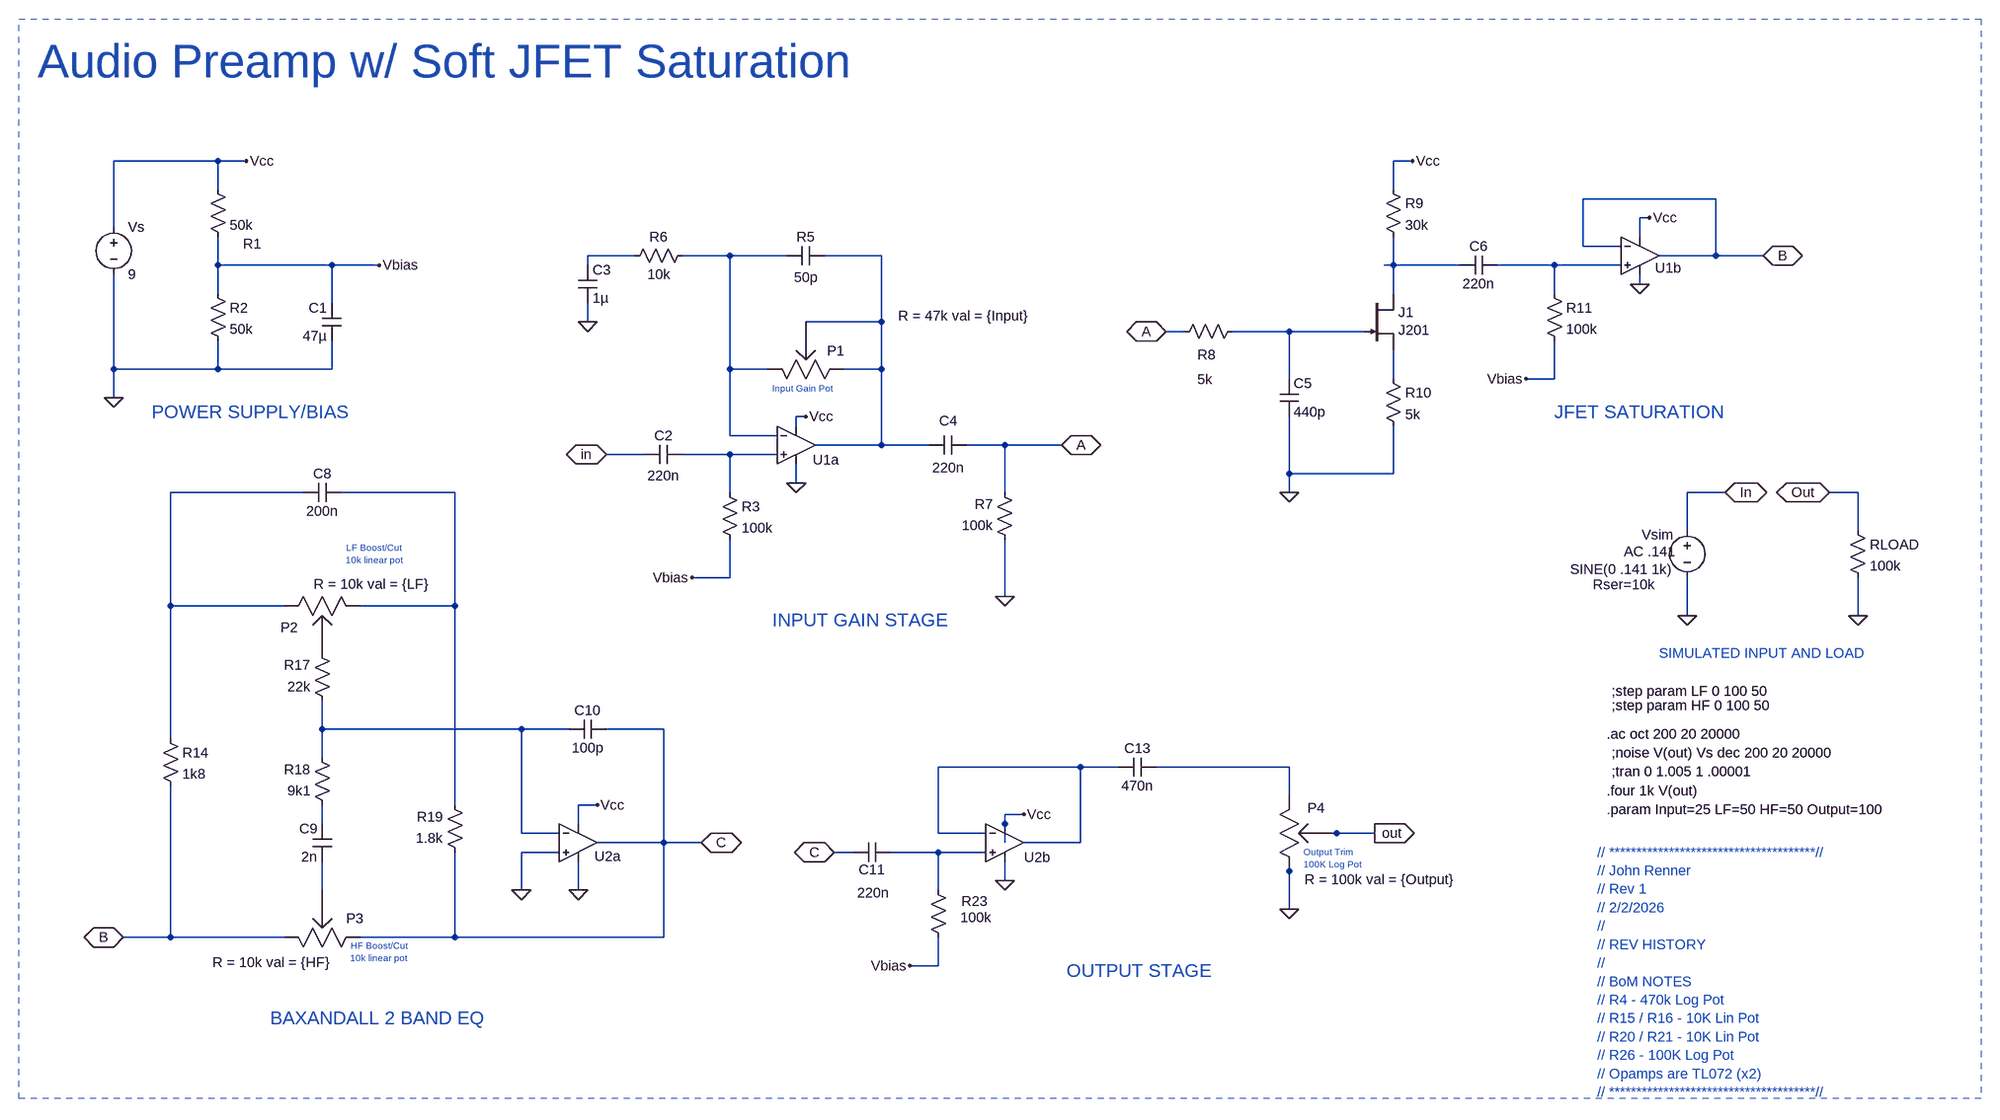
[diagram p0: schematic simulation.asc]
simulation.asc, the LTspice schematic file:
Version 4
SHEET 1 5132 1604
WIRE -912 -352 -1088 -352
WIRE -864 -352 -912 -352
WIRE 1104 -352 1072 -352
WIRE -912 -304 -912 -352
WIRE 1072 -304 1072 -352
WIRE 1616 -288 1392 -288
WIRE 1504 -256 1488 -256
WIRE -1088 -240 -1088 -352
WIRE 1488 -224 1488 -256
WIRE 1392 -208 1392 -288
WIRE 1456 -208 1392 -208
WIRE -208 -192 -288 -192
WIRE -48 -192 -128 -192
WIRE 48 -192 -48 -192
WIRE 208 -192 112 -192
WIRE 1616 -192 1616 -288
WIRE 1616 -192 1520 -192
WIRE 1696 -192 1616 -192
WIRE -912 -176 -912 -224
WIRE -720 -176 -912 -176
WIRE -640 -176 -720 -176
WIRE -288 -176 -288 -192
WIRE 1072 -176 1072 -224
WIRE 1072 -176 1056 -176
WIRE 1184 -176 1072 -176
WIRE 1344 -176 1248 -176
WIRE 1456 -176 1344 -176
WIRE 1488 -144 1488 -160
WIRE -912 -128 -912 -176
WIRE 1072 -128 1072 -176
WIRE 1344 -128 1344 -176
WIRE -720 -112 -720 -176
WIRE -288 -80 -288 -112
WIRE 208 -80 208 -192
WIRE 208 -80 80 -80
WIRE 720 -64 688 -64
WIRE 896 -64 800 -64
WIRE 1024 -64 896 -64
WIRE -1088 0 -1088 -160
WIRE -912 0 -912 -48
WIRE -912 0 -1088 0
WIRE -720 0 -720 -48
WIRE -720 0 -912 0
WIRE -48 0 -48 -192
WIRE 16 0 -48 0
WIRE 208 0 208 -80
WIRE 208 0 144 0
WIRE 896 16 896 -64
WIRE 1072 16 1072 -32
WIRE 1344 16 1344 -48
WIRE 1344 16 1296 16
WIRE -1088 48 -1088 0
WIRE 80 80 64 80
WIRE 64 96 64 80
WIRE -48 112 -48 0
WIRE 32 112 -48 112
WIRE 208 128 208 0
WIRE 208 128 96 128
WIRE 288 128 208 128
WIRE 416 128 352 128
WIRE 512 128 416 128
WIRE -192 144 -256 144
WIRE -48 144 -128 144
WIRE 32 144 -48 144
WIRE 896 176 896 80
WIRE 1072 176 1072 96
WIRE 1072 176 896 176
WIRE 64 192 64 160
WIRE -768 208 -992 208
WIRE -512 208 -704 208
WIRE -48 208 -48 144
WIRE 416 208 416 128
WIRE 896 208 896 176
WIRE 1632 208 1568 208
WIRE 1856 208 1808 208
WIRE 1568 272 1568 208
WIRE 1856 272 1856 208
WIRE -48 352 -48 288
WIRE -48 352 -112 352
WIRE 416 384 416 288
WIRE -992 400 -992 208
WIRE -800 400 -992 400
WIRE -512 400 -512 208
WIRE -512 400 -672 400
WIRE 1568 416 1568 352
WIRE 1856 416 1856 352
WIRE -736 608 -736 560
WIRE -400 608 -736 608
WIRE -320 608 -400 608
WIRE -160 608 -256 608
WIRE -992 624 -992 400
WIRE -736 656 -736 608
WIRE 544 672 304 672
WIRE 608 672 544 672
WIRE 896 672 672 672
WIRE 896 720 896 672
WIRE -512 736 -512 400
WIRE -272 736 -304 736
WIRE 448 752 416 752
WIRE -736 768 -736 736
WIRE -304 768 -304 736
WIRE 416 768 416 752
WIRE -400 784 -400 608
WIRE -336 784 -400 784
WIRE 304 784 304 672
WIRE 384 784 304 784
WIRE 976 784 960 784
WIRE 1040 784 976 784
WIRE -160 800 -160 608
WIRE -160 800 -272 800
WIRE -96 800 -160 800
WIRE 416 800 416 768
WIRE 544 800 544 672
WIRE 544 800 448 800
WIRE -336 816 -400 816
WIRE 160 816 128 816
WIRE 304 816 224 816
WIRE 384 816 304 816
WIRE 896 848 896 832
WIRE 416 864 416 832
WIRE -736 880 -736 832
WIRE -400 880 -400 816
WIRE -304 880 -304 832
WIRE 304 880 304 816
WIRE 896 912 896 848
WIRE -992 960 -992 704
WIRE -992 960 -1072 960
WIRE -800 960 -992 960
WIRE -512 960 -512 816
WIRE -512 960 -672 960
WIRE -160 960 -160 800
WIRE -160 960 -512 960
WIRE 304 1008 304 960
WIRE 304 1008 256 1008
FLAG -864 -352 Vcc
FLAG 1568 416 0
FLAG 80 80 Vcc
FLAG 1104 -352 Vcc
FLAG -1088 48 0
FLAG -640 -176 Vbias
FLAG -112 352 Vbias
FLAG 64 192 0
FLAG -272 736 Vcc
FLAG 416 384 0
FLAG -304 880 0
FLAG 1488 -144 0
FLAG 1504 -256 Vcc
FLAG 448 752 Vcc
FLAG 256 1008 Vbias
FLAG 416 864 0
FLAG 896 912 0
FLAG -288 -80 0
FLAG -400 880 0
FLAG 1296 16 Vbias
FLAG 1040 784 out
IOPIN 1040 784 Out
FLAG -256 144 in
IOPIN -256 144 BiDir
FLAG 896 208 0
FLAG 1696 -192 B
IOPIN 1696 -192 BiDir
FLAG -1072 960 B
IOPIN -1072 960 BiDir
FLAG 512 128 A
IOPIN 512 128 BiDir
FLAG 688 -64 A
IOPIN 688 -64 BiDir
FLAG -96 800 C
IOPIN -96 800 BiDir
FLAG 128 816 C
IOPIN 128 816 BiDir
FLAG 1856 416 0
FLAG 1808 208 Out
IOPIN 1808 208 BiDir
FLAG 1632 208 In
IOPIN 1632 208 BiDir
DATAFLAG -608 -128 "V(vbias)"
DATAFLAG 1056 -176 ""
DATAFLAG 1152 -16 "V(n007)"
DATAFLAG -992 -368 "-I(Vs)"
DATAFLAG -992 432 ""
DATAFLAG 896 -64 "V(n006)"
SYMBOL OpAmps\\UniversalOpAmp 64 128 R0
WINDOW 0 28 25 Left 2
SYMATTR InstName U1a
SYMBOL voltage 1568 256 R0
WINDOW 123 -107 52 Left 2
WINDOW 39 -159 108 Left 2
WINDOW 3 -198 82 Left 2
WINDOW 0 -77 24 Left 2
SYMATTR Value2 AC .141
SYMATTR SpiceLine Rser=10k
SYMATTR Value SINE(0 .141 1k)
SYMATTR InstName Vsim
SYMBOL cap -128 128 R90
WINDOW 0 0 32 VBottom 2
WINDOW 3 36 32 VTop 2
SYMATTR InstName C2
SYMATTR Value 220n
SYMBOL res -928 -320 R0
WINDOW 0 58 108 Left 2
SYMATTR InstName R1
SYMATTR Value 50k
SYMBOL res -928 -144 R0
SYMATTR InstName R2
SYMATTR Value 50k
SYMBOL voltage -1088 -256 R0
WINDOW 123 0 0 Left 0
WINDOW 39 0 0 Left 0
SYMATTR InstName Vs
SYMATTR Value 9
SYMBOL njf 1024 -128 R0
WINDOW 3 56 62 Left 2
SYMATTR Value J201
SYMATTR InstName J1
SYMBOL res 816 -80 R90
WINDOW 0 71 59 VBottom 2
WINDOW 3 82 62 VTop 2
SYMATTR InstName R8
SYMATTR Value 5k
SYMBOL res 432 304 R180
WINDOW 0 36 76 Left 2
WINDOW 3 36 40 Left 2
SYMATTR InstName R7
SYMATTR Value 100k
SYMBOL res 1056 0 R0
SYMATTR InstName R10
SYMATTR Value 5k
SYMBOL res 1056 -320 R0
SYMATTR InstName R9
SYMATTR Value 30k
SYMBOL cap 1248 -192 R90
WINDOW 0 0 32 VBottom 2
WINDOW 3 32 32 VTop 2
SYMATTR InstName C6
SYMATTR Value 220n
SYMBOL cap 352 112 R90
WINDOW 0 -9 31 VBottom 2
WINDOW 3 39 31 VTop 2
SYMATTR InstName C4
SYMATTR Value 220n
SYMBOL res -112 -208 R90
WINDOW 0 0 56 VBottom 2
WINDOW 3 32 56 VTop 2
SYMATTR InstName R6
SYMATTR Value 10k
SYMBOL cap -704 -48 R180
WINDOW 0 24 56 Left 2
WINDOW 3 24 8 Left 2
SYMATTR InstName C1
SYMATTR Value 47µ
SYMBOL OpAmps\\UniversalOpAmp -304 800 R0
WINDOW 0 28 23 Left 2
SYMATTR InstName U2a
SYMBOL cap -256 592 R90
WINDOW 0 0 32 VBottom 2
WINDOW 3 32 32 VTop 2
SYMATTR InstName C10
SYMATTR Value 100p
SYMBOL res -720 752 R180
WINDOW 0 36 76 Left 2
WINDOW 3 36 40 Left 2
SYMATTR InstName R18
SYMATTR Value 9k1
SYMBOL res -720 576 R180
WINDOW 0 36 76 Left 2
WINDOW 3 36 40 Left 2
SYMATTR InstName R17
SYMATTR Value 22k
SYMBOL cap -720 832 R180
WINDOW 0 24 56 Left 2
WINDOW 3 24 8 Left 2
SYMATTR InstName C9
SYMATTR Value 2n
SYMBOL cap -704 192 R90
WINDOW 0 0 32 VBottom 2
WINDOW 3 32 32 VTop 2
SYMATTR InstName C8
SYMATTR Value 200n
SYMBOL res -1008 608 R0
SYMATTR InstName R14
SYMATTR Value 1k8
SYMBOL res -496 832 R180
WINDOW 0 36 76 Left 2
WINDOW 3 36 40 Left 2
SYMATTR InstName R19
SYMATTR Value 1.8k
SYMBOL OpAmps\\UniversalOpAmp 1488 -192 R0
WINDOW 0 26 21 Left 2
SYMATTR InstName U1b
SYMBOL cap 112 -208 R90
WINDOW 0 0 32 VBottom 2
WINDOW 3 37 31 VTop 2
SYMATTR InstName R5
SYMATTR Value 50p
SYMBOL cap 880 16 R0
SYMATTR InstName C5
SYMATTR Value 440p
SYMBOL OpAmps\\UniversalOpAmp 416 800 R0
WINDOW 0 33 25 Left 2
SYMATTR InstName U2b
SYMBOL cap 672 656 R90
WINDOW 0 0 32 VBottom 2
WINDOW 3 32 32 VTop 2
SYMATTR InstName C13
SYMATTR Value 470n
SYMBOL res 320 976 R180
WINDOW 0 -67 77 Left 2
WINDOW 3 -74 50 Left 2
SYMATTR InstName R23
SYMATTR Value 100k
SYMBOL res -64 192 R0
SYMATTR InstName R3
SYMATTR Value 100k
SYMBOL cap 224 800 R90
WINDOW 0 61 32 VBottom 2
WINDOW 3 69 30 VTop 2
SYMATTR InstName C11
SYMATTR Value 220n
SYMBOL res 1328 -144 R0
SYMATTR InstName R11
SYMATTR Value 100k
SYMBOL res 1840 256 R0
SYMATTR InstName RLOAD
SYMATTR Value 100k
SYMBOL cap -304 -176 R0
SYMATTR InstName C3
SYMATTR Value 1µ
SYMBOL pot -688 384 R90
WINDOW 0 52 89 VRight 2
WINDOW 39 -21 -132 VRight 2
SYMATTR InstName P2
SYMATTR SpiceLine R = 10k val = {LF}
SYMBOL pot -688 976 M270
WINDOW 0 48 -22 VRight 2
WINDOW 39 -26 35 VRight 2
SYMATTR InstName P3
SYMATTR SpiceLine R = 10k val = {HF}
SYMBOL pot 880 832 M180
WINDOW 0 47 91 Left 2
WINDOW 39 42 -30 Left 2
SYMATTR InstName P4
SYMATTR SpiceLine R = 100k val = {Output}
SYMBOL pot 32 16 R270
WINDOW 0 47 84 VRight 2
WINDOW 39 106 204 VRight 2
SYMATTR InstName P1
SYMATTR SpiceLine R = 47k val = {Input}
TEXT 24 32 Left 1 ;Input Gain Pot
TEXT -648 312 Center 1 ;LF Boost/Cut\n10k linear pot
TEXT -640 984 Center 1 ;HF Boost/Cut\n10k linear pot
TEXT 24 424 Left 3 ;INPUT GAIN STAGE
TEXT 1344 72 Left 3 ;JFET SATURATION
TEXT -824 1096 Left 3 ;BAXANDALL 2 BAND EQ
TEXT 520 1016 Left 3 ;OUTPUT STAGE
TEXT 920 816 Left 1 ;Output Trim\n100K Log Pot
TEXT -1024 72 Left 3 ;POWER SUPPLY/BIAS
TEXT 1416 816 Left 2 ;// **************************************//\n// John Renner\n// Rev 1\n// 2/2/2026\n// \n// REV HISTORY\n// \n// BoM NOTES\n// R4 - 470k Log Pot\n// R15 / R16 - 10K Lin Pot\n// R20 / R21 - 10K Lin Pot\n// R26 - 100K Log Pot\n// Opamps are TL072 (x2)\n// **************************************//
TEXT -1216 -520 Left 6 ;Audio Preamp w/ Soft JFET Saturation
TEXT 1440 648 Left 2 !;noise V(out) Vs dec 200 20 20000
TEXT 1440 680 Left 2 !;tran 0 1.005 1 .00001
TEXT 1432 712 Left 2 !.four 1k V(out)
TEXT 1432 616 Left 2 !.ac oct 200 20 20000
TEXT 1520 480 Left 2 ;SIMULATED INPUT AND LOAD
TEXT 1432 744 Left 2 !.param Input=25 LF=50 HF=50 Output=100
TEXT 1440 544 Left 2 !;step param LF 0 100 50
TEXT 1440 568 Left 2 !;step param HF 0 100 50
RECTANGLE Normal 2064 1232 -1248 -592 2

The netlist it stands for:
* simulation.asc
XU1a N008 N002 Vcc 0 N003 level1 Avol=1Meg GBW=10Meg Vos=0 En=0 Enk=0 In=0 Ink=0 Rin=500Meg  ; pins In+ In- V+ V- OUT
Vsim in 0 SINE(0 .141 1k) AC .141 Rser=10k
C2 N008 in 220n
R1 Vcc Vbias 50k
R2 Vbias 0 50k
Vs Vcc 0 9
J1 N004 N006 N007 J201
R8 N006 A 5k
R7 0 A 100k
R10 N007 0 5k
R9 Vcc N004 30k
C6 N005 N004 220n
C4 A N003 220n
R6 N002 N001 10k
C1 0 Vbias 47µ
XU2a 0 N011 Vcc 0 C level1 Avol=1Meg GBW=10Meg Vos=0 En=0 Enk=0 In=0 Ink=0 Rin=500Meg  ; pins In+ In- V+ V- OUT
C10 C N011 100p
R18 N014 N011 9k1
R17 N011 P001 22k
C9 N016 N014 2n
C8 N010 N009 200n
R14 N009 B 1k8
R19 C N010 1.8k
XU1b N005 B Vcc 0 B level1 Avol=1Meg GBW=10Meg Vos=0 En=0 Enk=0 In=0 Ink=0 Rin=500Meg  ; pins In+ In- V+ V- OUT
C§R5 N003 N002 50p
C5 N006 0 440p
XU2b N015 N012 Vcc 0 N012 level1 Avol=1Meg GBW=10Meg Vos=0 En=0 Enk=0 In=0 Ink=0 Rin=500Meg  ; pins In+ In- V+ V- OUT
C13 N013 N012 470n
R23 Vbias N015 100k
R3 N008 Vbias 100k
C11 N015 C 220n
R11 N005 Vbias 100k
RLOAD out 0 100k
C3 N001 0 1µ
XP2 N010 P001 N009 pot R = 10k val = {LF}  ; pins A B C
XP3 C N016 B pot R = 10k val = {HF}  ; pins A B C
XP4 0 out N013 pot R = 100k val = {Output}  ; pins A B C
XP1 N002 N003 N003 pot R = 47k val = {Input}  ; pins A B C
.model NJF NJF
.model PJF PJF
.lib standard.jft
* Input Gain Pot
* LF Boost/Cut
* 10k linear pot
* HF Boost/Cut
* 10k linear pot
* INPUT GAIN STAGE
* JFET SATURATION
* BAXANDALL 2 BAND EQ
* OUTPUT STAGE
* Output Trim
* 100K Log Pot
* POWER SUPPLY/BIAS
* // **************************************//
* // John Renner
* // Rev 1
* // 2/2/2026
* //
* // REV HISTORY
* //
* // BoM NOTES
* // R4 - 470k Log Pot
* // R15 / R16 - 10K Lin Pot
* // R20 / R21 - 10K Lin Pot
* // R26 - 100K Log Pot
* // Opamps are TL072 (x2)
* // **************************************//
* Audio Preamp w/ Soft JFET Saturation
;noise V(out) Vs dec 200 20 20000
;tran 0 1.005 1 .00001
.four 1k V(out)
.ac oct 200 20 20000
* SIMULATED INPUT AND LOAD
.param Input=25 LF=50 HF=50 Output=100
;step param LF 0 100 50
;step param HF 0 100 50
.lib UniversalOpAmp1.lib
.backanno
.end